# Altium schematic sheet Carte_Keil_Emile_can_v0.SchDoc
size A3; SheetNumber: 1; SheetTotal: 2
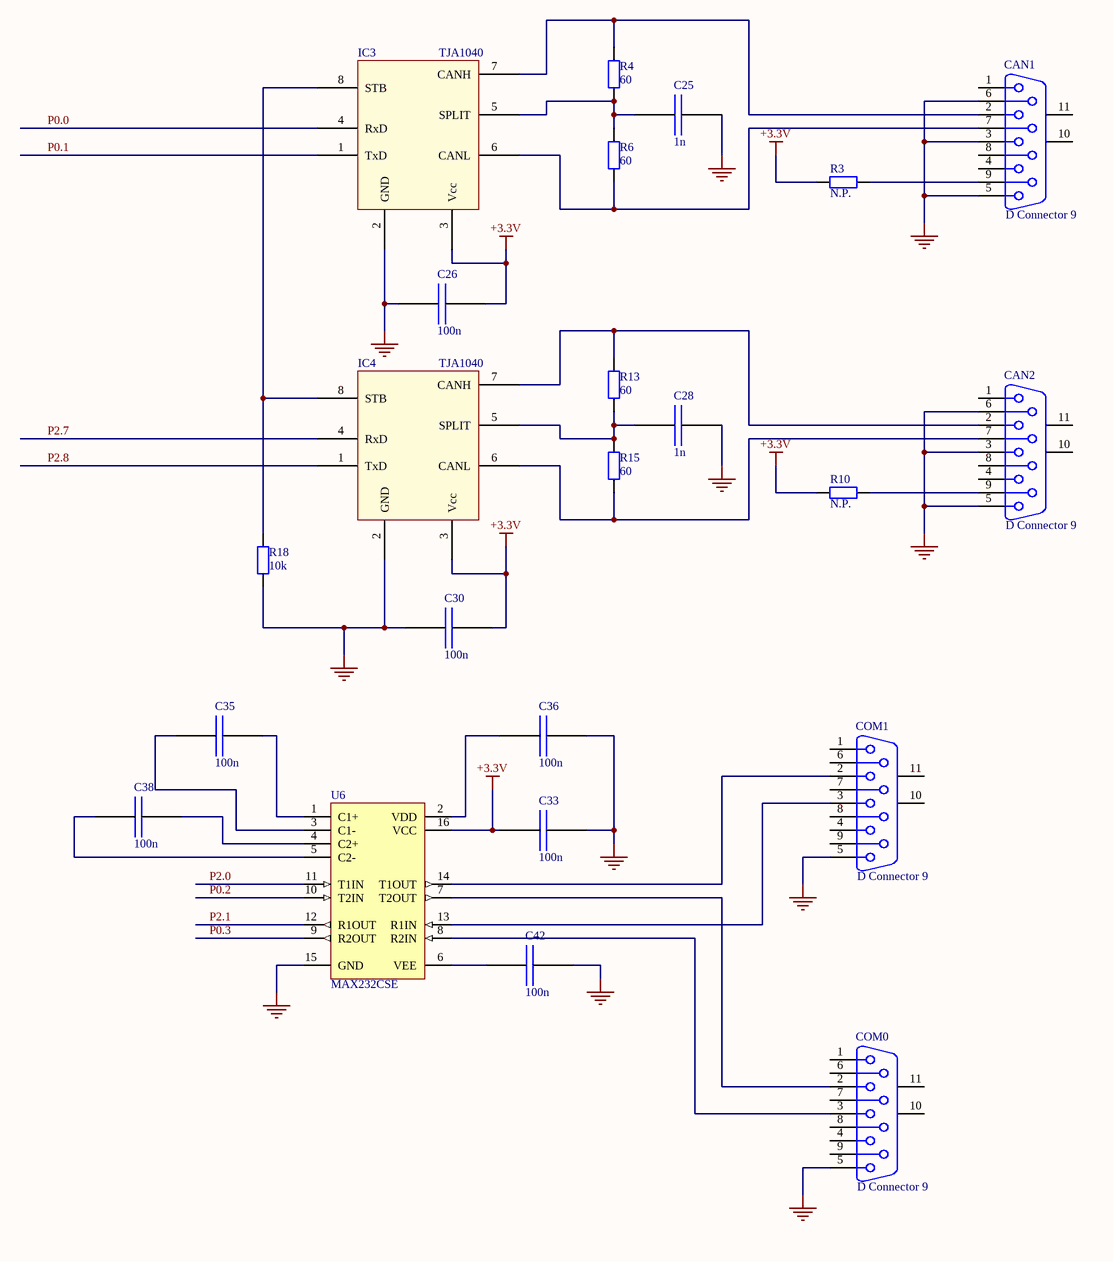
[diagram p0: Carte_Keil_Emile_can_v0.SchDoc]

## Parts
C25  1n  [Res_1206]
C26  100n  [Res_1206]
C28  1n  [Res_1206]
C30  100n  [Res_1206]
C33  100n  [Res_1206]
C35  100n  [Res_1206]
C36  100n  [Res_1206]
C38  100n  [Res_1206]
C42  100n  [Res_1206]
CAN1  D Connector 9  [DSUB1.385-2H9]
CAN2  D Connector 9  [DSUB1.385-2H9]
COM0  D Connector 9  [DSUB1.385-2H9]
COM1  D Connector 9  [DSUB1.385-2H9]
IC3  TJA1040  [SO-G8]
IC4  TJA1040  [SO-G8]
R3  value N.P.  [CR3216-1206]  (hidden comment: Res)
R4  value 60  [CR3216-1206]  (hidden comment: Res)
R6  value 60  [CR3216-1206]  (hidden comment: Res)
R10  value N.P.  [CR3216-1206]  (hidden comment: Res)
R13  value 60  [CR3216-1206]  (hidden comment: Res)
R15  value 60  [CR3216-1206]  (hidden comment: Res)
R18  value 10k  [CR3216-1206]  (hidden comment: Res)
U6  MAX232CSE  [NSO16]

## Nets
+3.3V: C26.2 C30.2 C33.1 IC3.3(Vcc) IC4.3(Vcc) R3.2 R10.2 U6.16(VCC)
GND: C25.2 C26.1 C28.2 C30.1 C33.2 C36.2 C42.2 CAN1.3 CAN1.5 CAN1.6 CAN2.3 CAN2.5 CAN2.6 COM0.5 COM1.5 IC3.2(GND) IC4.2(GND) R18.2 U6.15(GND)
P0.0: IC3.4(RxD)
P0.1: IC3.1(TxD)
P0.2: U6.10(T2IN)
P0.3: U6.9(R2OUT)
P2.0: U6.11(T1IN)
P2.1: U6.12(R1OUT)
P2.7: IC4.4(RxD)
P2.8: IC4.1(TxD)
NetC25_1: C25.1 IC3.5(SPLIT) R4.2 R6.1
NetC28_1: C28.1 IC4.5(SPLIT) R13.2 R15.1
NetC35_1: C35.1 U6.3(C1-)
NetC35_2: C35.2 U6.1(C1+)
NetC36_1: C36.1 U6.2(VDD)
NetC38_1: C38.1 U6.5(C2-)
NetC38_2: C38.2 U6.4(C2+)
NetC42_1: C42.1 U6.6(VEE)
NetCAN1_2: CAN1.2 IC3.7(CANH) R4.1
NetCAN1_7: CAN1.7 IC3.6(CANL) R6.2
NetCAN1_9: CAN1.9 R3.1
NetCAN2_2: CAN2.2 IC4.7(CANH) R13.1
NetCAN2_7: CAN2.7 IC4.6(CANL) R15.2
NetCAN2_9: CAN2.9 R10.1
NetCOM0_2: COM0.2 U6.7(T2OUT)
NetCOM0_3: COM0.3 U6.8(R2IN)
NetCOM1_2: COM1.2 U6.14(T1OUT)
NetCOM1_3: COM1.3 U6.13(R1IN)
NetIC3_8: IC3.8(STB) IC4.8(STB) R18.1

Not connected (* = marked no-connect by the designer): CAN1 1 4 8 10(MH1) 11(MH2); CAN2 1 4 8 10(MH1) 11(MH2); COM0 1 4 6 7 8 9 10(MH1) 11(MH2); COM1 1 4 6 7 8 9 10(MH1) 11(MH2)

## Library data of the parts
C25 C26 C28 C30 C33 C35 C36 C38 C42 = Capa_1206
CAN1 CAN2 COM0 COM1 = D Connector 9: Receptacle Assembly, 9 Position, Right Angle; PackageDocument: O; Positions: 9; Published: 15-Jun-2001; LatestRevisionDate: 17-Jul-2002; LatestRevisionNote: Re-released for DXP Platform.; DatasheetDocument: 1-Sep-1999; PackageReference: 788750; Publisher: Altium Limited; Orientation: Right Angle; Gender: Receptacle
IC3 IC4 = TJA1040: CAN bus transceiver
R3 R4 R6 R10 R13 R15 R18 = Res: Resistance; Published: 8-Jun-2000; Revision: July-2002: Re-released for DXP Platform.; Publisher: Altium Limited
U6 = MAX232CSE: +5V Powered, Multi-Channel RS-232 Driver/Receiver; Published: 16-Jan-2001; LatestRevisionDate: 6-Jun-2005; LatestRevisionNote: Stylized 3D Model Added.; PackageReference: NSO16; Publisher: Altium Limited; Code_JEDEC: MS-012-AC; Code_IPC: SO16; ComponentLink1Description: Manufacturer Link; ComponentLink1URL: http://www.maxim-ic.com/; ComponentLink2Description: Datasheet; ComponentLink2URL: http://pdfserv.maxim-ic.com/en/ds/MAX220-MAX249.pdf